# EAGLE design RPI_SmartServo_th (EAGLE 7.5.0)
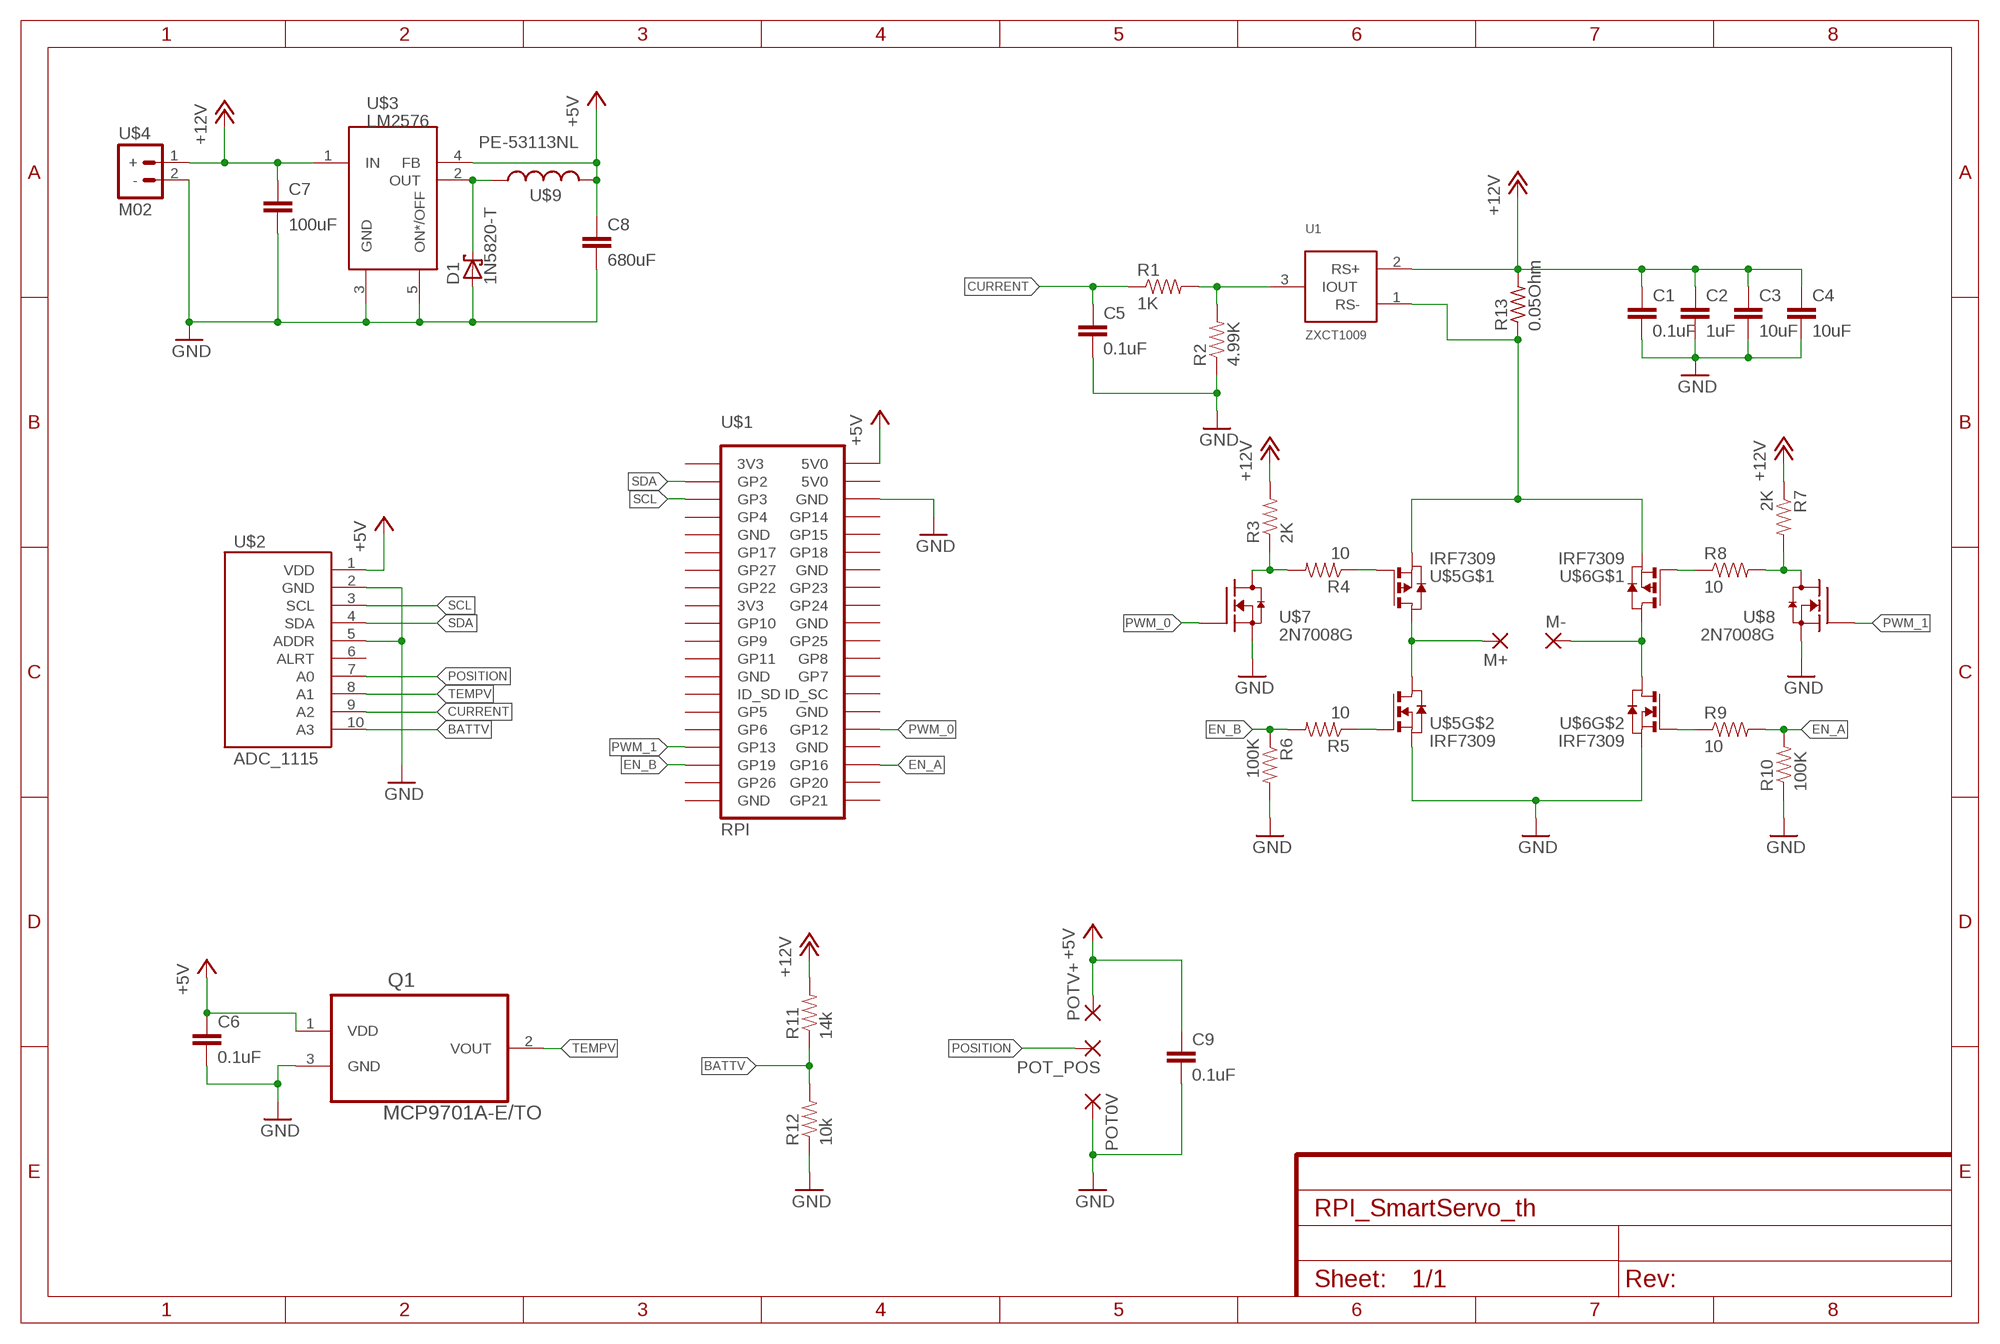
[diagram p0: schematic, sheet 1]

## Parts
C1  0.1uF  C-EU025-025X050  [C025-025X050]
C2  1uF  C-EU025-025X050  [C025-025X050]
C3  10uF  C-EU025-025X050  [C025-025X050]
C4  10uF  C-EU025-025X050  [C025-025X050]
C5  0.1uF  C-EU025-025X050  [C025-025X050]
C6  0.1uF  C-EU025-025X050  [C025-025X050]
C7  100uF  C-EU025-025X050  [C025-025X050]
C8  680uF  C-EU025-025X050  [C025-025X050]
C9  0.1uF  C-EU025-025X050  [C025-025X050]
D1  1N5820-T  SCHOTTKY-DIODEC4111-15  [C4111-15]
M+  1,6/0,9  [1,6/0,9]
M-  1,6/0,9  [1,6/0,9]
POT0V  1,6/0,9  [1,6/0,9]
POT_POS  1,6/0,9  [1,6/0,9]
POTV+  1,6/0,9  [1,6/0,9]
Q1  MCP9701A-E/TO  [TO127P254X533-3]
R1  1K  RESISTORPTH-1/4W  [AXIAL-0.4]
R2  4.99K  RESISTORPTH-1/4W  [AXIAL-0.4]
R3  2K  RESISTORPTH-1/4W  [AXIAL-0.4]
R4  10  RESISTORPTH-1/4W  [AXIAL-0.4]
R5  10  RESISTORPTH-1/4W  [AXIAL-0.4]
R6  100K  RESISTORPTH-1/4W  [AXIAL-0.4]
R7  2K  RESISTORPTH-1/4W  [AXIAL-0.4]
R8  10  RESISTORPTH-1/4W  [AXIAL-0.4]
R9  10  RESISTORPTH-1/4W  [AXIAL-0.4]
R10  100K  RESISTORPTH-1/4W  [AXIAL-0.4]
R11  14k  RESISTORPTH-1/4W  [AXIAL-0.4]
R12  10k  RESISTORPTH-1/4W  [AXIAL-0.4]
R13  0.05Ohm  R-US_0922/22  [0922/22]
U1  ZXCT1009  [SOT23]
U$1  RPI  [2X20]
U$2  ADC_1115  [1X10]
U$3  LM2576  [LM2576]
U$4  M02  [1X02]
U$5  IRF7309  [SO8]
U$6  IRF7309  [SO8]
U$7  2N7008G  [TO-92]
U$8  2N7008G  [TO-92]
U$9  PE-53113NL  [KM-4]

## Nets
+5V: C6.1 C8.1 C9.1 POTV+.1(P) Q1.1(VDD) U$1.2(5V0) U$2.1(VDD) U$3.4(FB) U$9.P$2
+12V: C1.1 C2.1 C3.1 C4.1 C7.1 R3.P$2 R7.P$1 R11.P$2 R13.2 U1.2(RS+) U$3.1(IN) U$4.1(+)
BATTV: R11.P$1 R12.P$2 U$2.10(A3)
CURRENT: C5.1 R1.P$1 U$2.9(A2)
EN_A: R9.P$2 R10.P$2 U$1.36(GP16)
EN_B: R5.P$2 R6.P$1 U$1.35(GP19)
GND: C1.2 C2.2 C3.2 C4.2 C5.2 C6.2 C7.2 C8.2 C9.2 D1.A POT0V.1(P) Q1.3(GND) R2.P$1 R6.P$2 R10.P$1 R12.P$1 U$1.6(GND) U$2.2(GND) U$2.5(ADDR) U$3.3(GND) U$3.5(ON*/OFF) U$4.2(-) U$5.1(S) U$6.1(S) U$7.1(S) U$8.1(S)
N$1: R1.P$2 R2.P$2 U1.3(IOUT)
N$4: M+.1(P) U$5.5(D) U$5.6(D) U$5.7(D) U$5.8(D)
N$5: R5.P$1 U$5.2(G)
N$6: R4.P$1 U$5.4(G)
N$7: M-.1(P) U$6.5(D) U$6.6(D) U$6.7(D) U$6.8(D)
N$8: R9.P$1 U$6.2(G)
N$9: R8.P$1 U$6.4(G)
N$10: D1.C U$3.2(OUT) U$9.P$1
N$12: R13.1 U1.1(RS-) U$5.3(S) U$6.3(S)
N$18: R3.P$1 R4.P$2 U$7.3(D)
N$21: R7.P$2 R8.P$2 U$8.3(D)
POSITION: POT_POS.1(P) U$2.7(A0)
PWM_0: U$1.32(GP12) U$7.2(G)
PWM_1: U$1.33(GP13) U$8.2(G)
SCL: U$1.5(GP3) U$2.3(SCL)
SDA: U$1.3(GP2) U$2.4(SDA)
TEMPV: Q1.2(VOUT) U$2.8(A1)
Unconnected: U$1.1(3V3) U$1.4(5V0) U$1.7(GP4) U$1.8(GP14) U$1.9(GND) U$1.10(GP15) U$1.11(GP17) U$1.12(GP18) U$1.13(GP27) U$1.14(GND) U$1.15(GP22) U$1.16(GP23) U$1.17(3V3) U$1.18(GP24) U$1.19(GP10) U$1.20(GND) U$1.21(GP9) U$1.22(GP25) U$1.23(GP11) U$1.24(GP8) U$1.25(GND) U$1.26(GP7) U$1.27(ID_SD) U$1.28(ID_SC) U$1.29(GP5) U$1.30(GND) U$1.31(GP6) U$1.34(GND) U$1.37(GP26) U$1.38(GP20) U$1.39(GND) U$1.40(GP21) U$2.6(ALRT)

## Library data of the parts
C1-C9 = rcl:C-EU: CAPACITOR, European symbol
D1 = adafruit:SCHOTTKY-DIODE: Schottky Diode
M+ M- POT0V POT_POS POTV+ = wirepad:1,6/0,9: THROUGH-HOLE PAD
Q1 = 00LibreriaErle:MCP9701A-E/TO: THERMISTOR, LINEAR 19, 5MV/C; MPN: MCP9701A-E/TO; OC_FARNELL: 1439484; OC_NEWARK: 17M0680; PACKAGE: TO-92-3; SUPPLIER: Microchip
R1-R12 = SparkFun-Resistors:RESISTOR: Resistor Basic schematic elements and footprints for 0603, 1206, and PTH resistors.
R13 = resistor:R-US_: RESISTOR, American symbol
U1 = 00LibreriaErle:ZXCT1009: ZXCT1009 Current Monitor (current output) http://www.diodes.com/zetex/_pdfs/3.0/pdf/ZXCT1009.pdf
U$1 = 00LibreriaErle:RPI: RPI pin header
U$2 = 00LibreriaErle:ADC_1115: ADC_1115 pin header for breakout board
U$3 = 00LibreriaErle:LM2576: LM2576 - 5V switching regulator
U$4 = 00LibreriaErle:M02
U$5 U$6 = 00LibreriaErle:IRF7309: IRF7309 PN MOSFET
U$7 U$8 = 00LibreriaErle:2N7008G: 2N7008-G-ND THROUGH HOLE DEVICE
U$9 = 00LibreriaErle:PE-53113NL

## Board
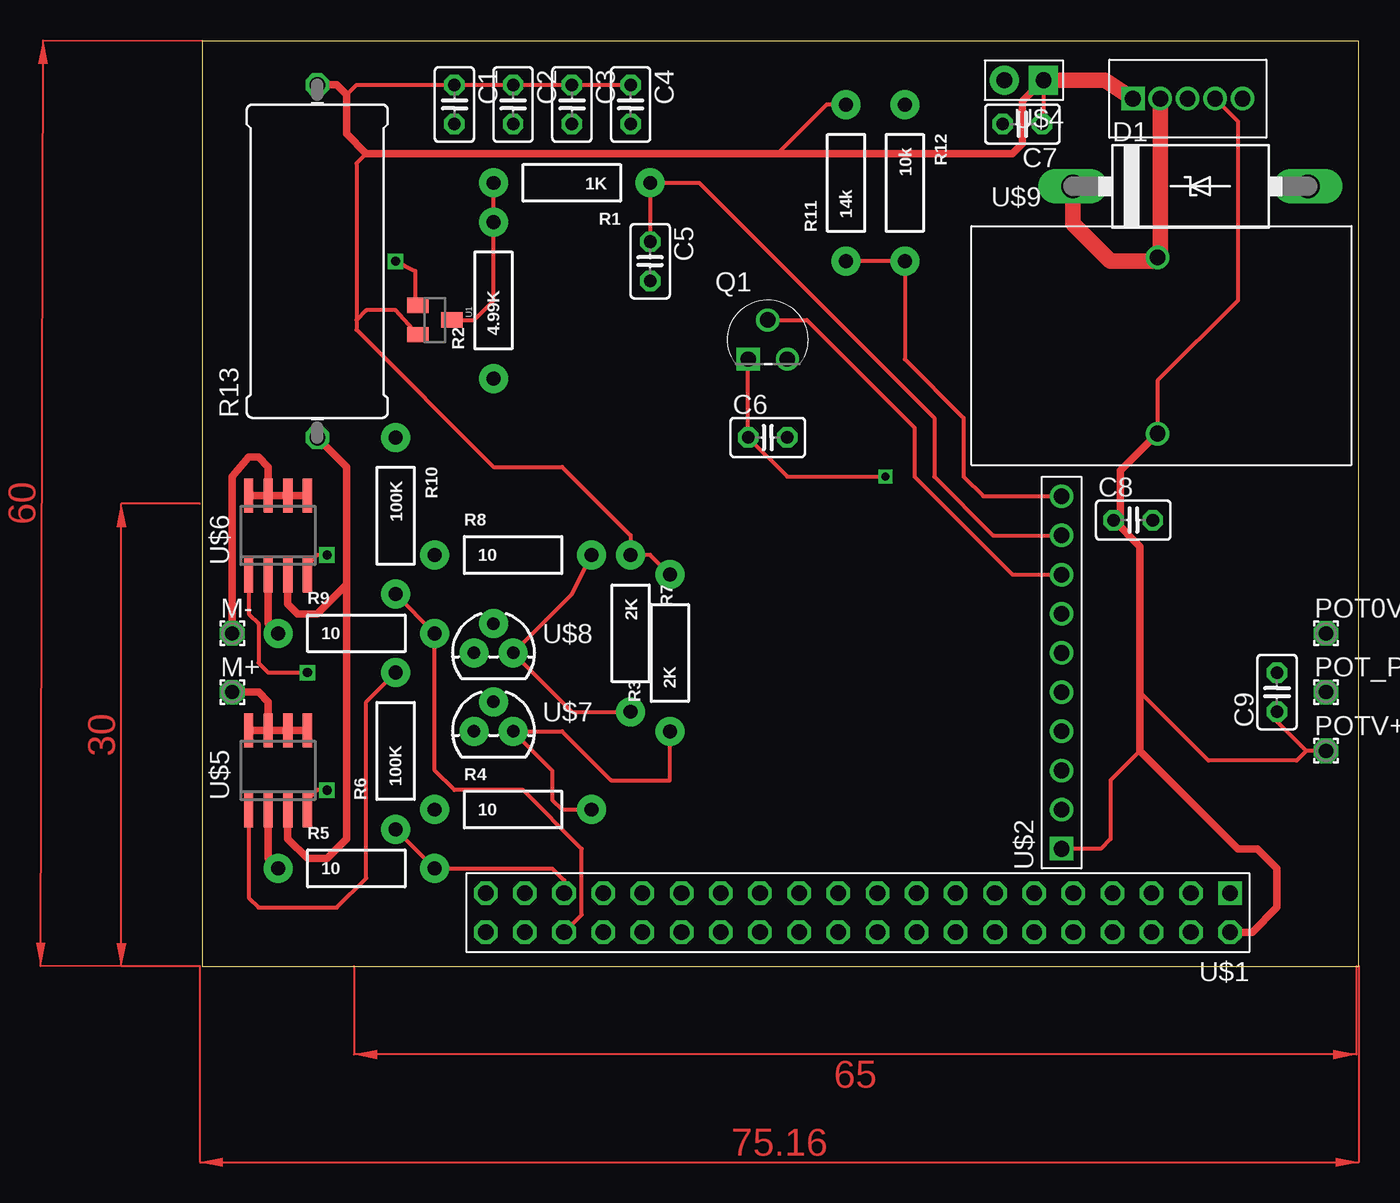
[diagram p1: board, top side]
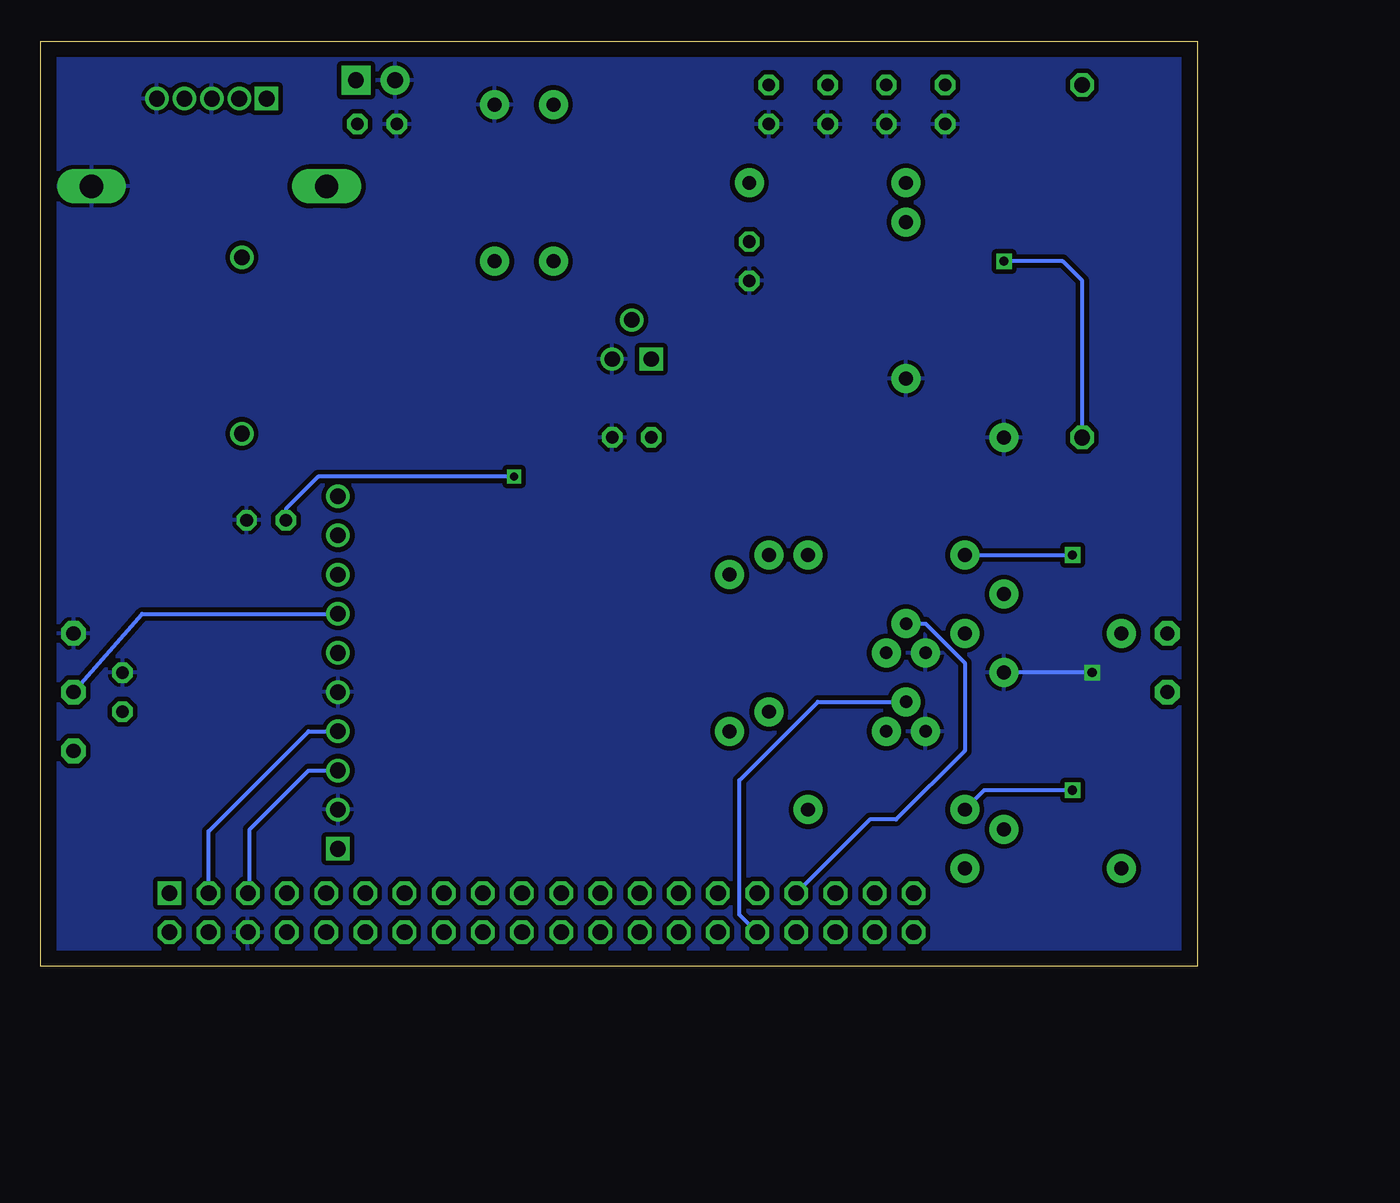
[diagram p2: board, bottom side, seen from below]

Size 75 x 60 mm. Coordinates in mm from the lower left corner, seen from the top.
Outline: 0,0 75,0 75,60 0,60 0,0
Copper layers (1*16): Top 0.035mm / dielectric 1.5mm / Bottom 0.035mm
Design rules "default": minimum track width 10mil, minimum drill 24mil, track to track 8mil, track to pad 8mil, pad to pad 8mil, via to via 8mil, smd to smd 8mil, copper to edge 40mil, drill to drill 8mil, minimum pad ring 10mil, minimum via ring 8mil, stop-mask expansion 4mil, vias tented up to drill 0mil, thermal gap 10mil

### Footprints (pad centres in the part's own frame; a part is rotated, then mirrored left to right if it is on the bottom)
C025-025X050 = drill 0.813 octagon: 1 -1.27,0; 2 1.27,0
C4111-15 = drill 1.499 long: A 7.62,0; C -7.62,0
1,6/0,9 = drill 0.914 pad 1.6 octagon: 1 0,0
TO127P254X533-3 = drill 0.991 square: 1 -2.54,-2.54 | drill 0.991: 2 -1.27,0; 3 0,-2.54
AXIAL-0.4 = drill 0.9 pad 1.88: P$1 -5.08,0; P$2 5.08,0
0922/22 = drill 1.016 octagon: 1 -11.43,0; 2 11.43,0
SOT23 = smd 1 x 1.4: 1 -0.95,-1.1; 2 0.95,-1.1; 3 0,1.1
2X20 = drill 1.016 square: 1 -24.13,-1.27 | drill 1.016 octagon: 2 -24.13,1.27; 3 -21.59,-1.27; 4 -21.59,1.27; 5 -19.05,-1.27; 6 -19.05,1.27; 7 -16.51,-1.27; 8 -16.51,1.27; 9 -13.97,-1.27; 10 -13.97,1.27; 11 -11.43,-1.27; 12 -11.43,1.27; 13 -8.89,-1.27; 14 -8.89,1.27; 15 -6.35,-1.27; 16 -6.35,1.27; 17 -3.81,-1.27; 18 -3.81,1.27; 19 -1.27,-1.27; 20 -1.27,1.27; 21 1.27,-1.27; 22 1.27,1.27; 23 3.81,-1.27; 24 3.81,1.27; 25 6.35,-1.27; 26 6.35,1.27; 27 8.89,-1.27; 28 8.89,1.27; 29 11.43,-1.27; 30 11.43,1.27; 31 13.97,-1.27; 32 13.97,1.27; 33 16.51,-1.27; 34 16.51,1.27; 35 19.05,-1.27; 36 19.05,1.27; 37 21.59,-1.27; 38 21.59,1.27; 39 24.13,-1.27; 40 24.13,1.27
1X10 = drill 1.016 square: 1 -11.43,0 | drill 1.016: 2 -8.89,0; 3 -6.35,0; 4 -3.81,0; 5 -1.27,0; 6 1.27,0; 7 3.81,0; 8 6.35,0; 9 8.89,0; 10 11.43,0
LM2576 = drill 1.016 square: 1 -3.556,0 | drill 1.016: 2 -1.778,0; 3 0,0; 4 1.778,0; 5 3.556,0
1X02 = drill 1.016 pad 1.88 square: 1 0,0 | drill 1.016 pad 1.88: 2 2.54,0
SO8 = smd 0.6 x 2.2: 1 -1.905,-2.6; 2 -0.635,-2.6; 3 0.635,-2.6; 4 1.905,-2.6; 5 1.905,2.6; 6 0.635,2.6; 7 -0.635,2.6; 8 -1.905,2.6
TO-92 = drill 0.813 pad 1.88: 1 -1.27,0; 2 0,1.905; 3 1.27,0
KM-4 = drill 1.016: P$1 12.065,-2.032; P$2 12.065,-13.462

### Placement (x,y rotation side)
C1  16.35,55.88 270 top
C2  20.16,55.88 270 top
C3  23.97,55.88 270 top
C4  27.78,55.88 270 top
C5  29.05,45.72 270 top
C6  36.67,34.29 0 top
C7  53.18,54.61 180 top
C8  60.37,28.93 0 top
C9  69.69,17.78 90 top
D1  64.08,50.57 0 top
M+  1.95,17.78 0 top
M-  1.95,21.59 0 top
POT0V  72.87,21.59 0 top
POT_POS  72.87,17.78 0 top
POTV+  72.87,13.97 0 top
Q1  37.94,41.91 0 top
R1  23.97,50.8 180 top
R2  18.89,43.18 90 top
R3  30.32,20.32 90 top
R4  20.16,10.16 0 top
R5  10,6.35 0 top
R6  12.54,13.97 90 top
R7  27.78,21.59 270 top
R8  20.16,26.67 0 top
R9  10,21.59 0 top
R10  12.54,29.21 270 top
R11  41.75,50.8 90 top
R12  45.56,50.8 270 top
R13  7.46,45.72 90 top
U1  15.08,41.91 270 top
U$1  42.51,3.48 180 top
U$2  55.72,19.05 90 top
U$3  63.9,56.26 0 top
U$4  54.55,57.45 180 top
U$5  4.92,12.7 0 top
U$6  4.92,27.94 0 top
U$7  18.89,15.24 0 top
U$8  18.89,20.32 0 top
U$9  49.88,48.01 0 top

### Tracks (layer width: path | path; a pad name or v marks a point on that pad's centre or on a via)
+5V  (via drill 0.51)
  Top 0.254: POTV+.1 71.59,13.97 | 71.59,13.97 69.69,15.88 C9.1 | 60.8,13.97 58.9,12.06 58.9,8.26 58.26,7.62 U$2.1 | 71.59,13.97 70.96,13.34 65.25,13.34 60.8,17.78 | v44.29,31.75 37.94,31.75 C6.1 Q1.1 | U$3.4 67.15,54.79 67.15,43.18 61.94,37.97 U$9.P$2
  Top 0.5: U$1.2 68.09,2.21 69.69,3.81 69.69,6.35 68.42,7.62 67.15,7.62 60.8,13.97 60.8,17.78 60.8,27.23 C8.1 59.25,28.93 59.53,29.21 59.53,32.13 U$9.P$2
  Bottom 0.254: v44.29,31.75 56.99,31.75 59.1,29.64 C8.1
+12V
  Top 0.254: R3.P$2 29.05,26.67 R7.P$1 27.78,27.94 23.34,32.38 18.89,32.38 10,41.27 10,41.91 | 9.37,56.52 10,57.15 C1.1 C2.1 C3.1 C4.1 | 10.63,52.7 10,52.07 10,41.91 | R11.P$2 40.48,55.88 37.31,52.7 | U$4.1 54.55,54.71 C7.1 | U1.2 12.54,42.55 10.63,42.55 10,41.91
  Top 0.5: U$4.1 53.18,56.08 53.18,53.34 52.55,52.7 37.31,52.7 10.63,52.7 9.37,53.98 9.37,56.52 8.73,57.15 R13.2
  Top 1.016: U$3.1 58.51,57.45 U$4.1
BATTV
  Top 0.254: R11.P$1 R12.P$2 45.56,39.37 49.37,35.56 49.37,31.75 50.64,30.48 U$2.10
CURRENT
  Top 0.254: U$2.9 51.28,27.94 47.47,31.75 47.47,35.56 32.23,50.8 R1.P$1 C5.1
EN_A
  Top 0.254: U$1.36 24.61,3.35 24.61,7.62 20.79,11.43 16.35,11.43 15.08,12.7 | 15.08,12.7 R9.P$2 | R9.P$2 R10.P$2 R9.P$2 | 15.08,12.7 R9.P$2
EN_B
  Top 0.254: R6.P$1 R5.P$2 22.7,6.35 23.46,5.59 U$1.35
GND  (via drill 0.6)
  Top 0.254: U$6.1 3.01,22.86 3.65,22.23 3.65,19.68 4.29,19.05 v6.83,19.05 | U$5.1 3.01,4.45 3.65,3.81 8.73,3.81 10.63,5.71 10.63,17.14 R6.P$2
  Bottom 0.254: v6.83,19.05 R6.P$2
  pour Bottom (isolate 0.305): -0.16,0 -0.16,59.69 74.77,59.69 74.77,0
N$1
  Top 0.254: R1.P$2 R2.P$2 18.89,43.18 17.62,41.91 U1.3
N$4
  Top 0.5: U$5.7 U$5.6 U$5.5 | U$5.7 4.29,17.14 3.65,17.78 M+.1 | U$5.8 U$5.7
N$5
  Top 0.5: R5.P$1 4.29,6.99 U$5.2
N$6  (via drill 0.6)
  Top 0.254: v8.1,11.43 7.46,11.43 6.83,10.79 U$5.4
  Bottom 0.254: R4.P$1 13.81,11.43 v8.1,11.43
N$7
  Top 0.5: U$6.7 U$6.6 U$6.5 | U$6.7 4.29,32.38 3.65,33.02 3.01,33.02 1.95,31.75 M-.1 | U$6.7 U$6.8
N$8
  Top 0.5: R9.P$1 4.29,22.23 U$6.2
N$9  (via drill 0.6)
  Top 0.254: v8.1,26.67 7.46,26.67 6.83,26.04 U$6.4
  Bottom 0.254: R8.P$1 v8.1,26.67
N$10
  Top 1.016: U$3.2 62.12,46.15 U$9.P$1 61.69,45.72 58.9,45.72 56.46,48.16 D1.C
N$12  (via drill 0.6)
  Top 0.254: v12.54,45.72 13.81,45.09 13.81,43.18 U1.1
  Top 0.5: R13.1 9.37,32.38 9.37,24.77 | 9.37,24.77 7.46,22.86 6.19,22.86 5.55,23.5 U$6.3 | U$5.3 5.55,8.26 6.83,6.99 8.1,6.99 9.37,8.26 9.37,24.77
  Bottom 0.254: R13.1 7.46,44.45 8.73,45.72 v12.54,45.72
N$18
  Top 0.254: R4.P$2 23.34,10.16 22.7,10.79 22.7,12.7 U$7.3 23.34,15.24 26.51,12.06 30.32,12.06 R3.P$1
N$21
  Top 0.254: R7.P$2 23.97,16.51 U$8.3 23.97,24.13 R8.P$2
POSITION
  Bottom 0.254: POT_POS.1 68.42,22.86 U$2.7
PWM_0
  Bottom 0.254: U$1.32 29.68,3.35 29.68,12.06 24.61,17.14 U$7.2
PWM_1
  Bottom 0.254: U$8.2 17.62,22.23 15.08,19.68 15.08,13.97 19.52,9.53 21.23,9.53 U$1.33
SCL
  Bottom 0.254: U$1.5 61.44,4.88 61.44,8.89 57.62,12.7 U$2.3
SDA
  Bottom 0.254: U$1.3 64.1,8.76 57.62,15.24 U$2.4
TEMPV
  Top 0.254: Q1.2 39.21,41.91 46.2,34.92 46.2,31.75 52.55,25.4 U$2.8
(copper drawn outside any net)
  shapes: Top area x4